# Altium schematic sheet [4] Programming_UART.SchDoc
size A4
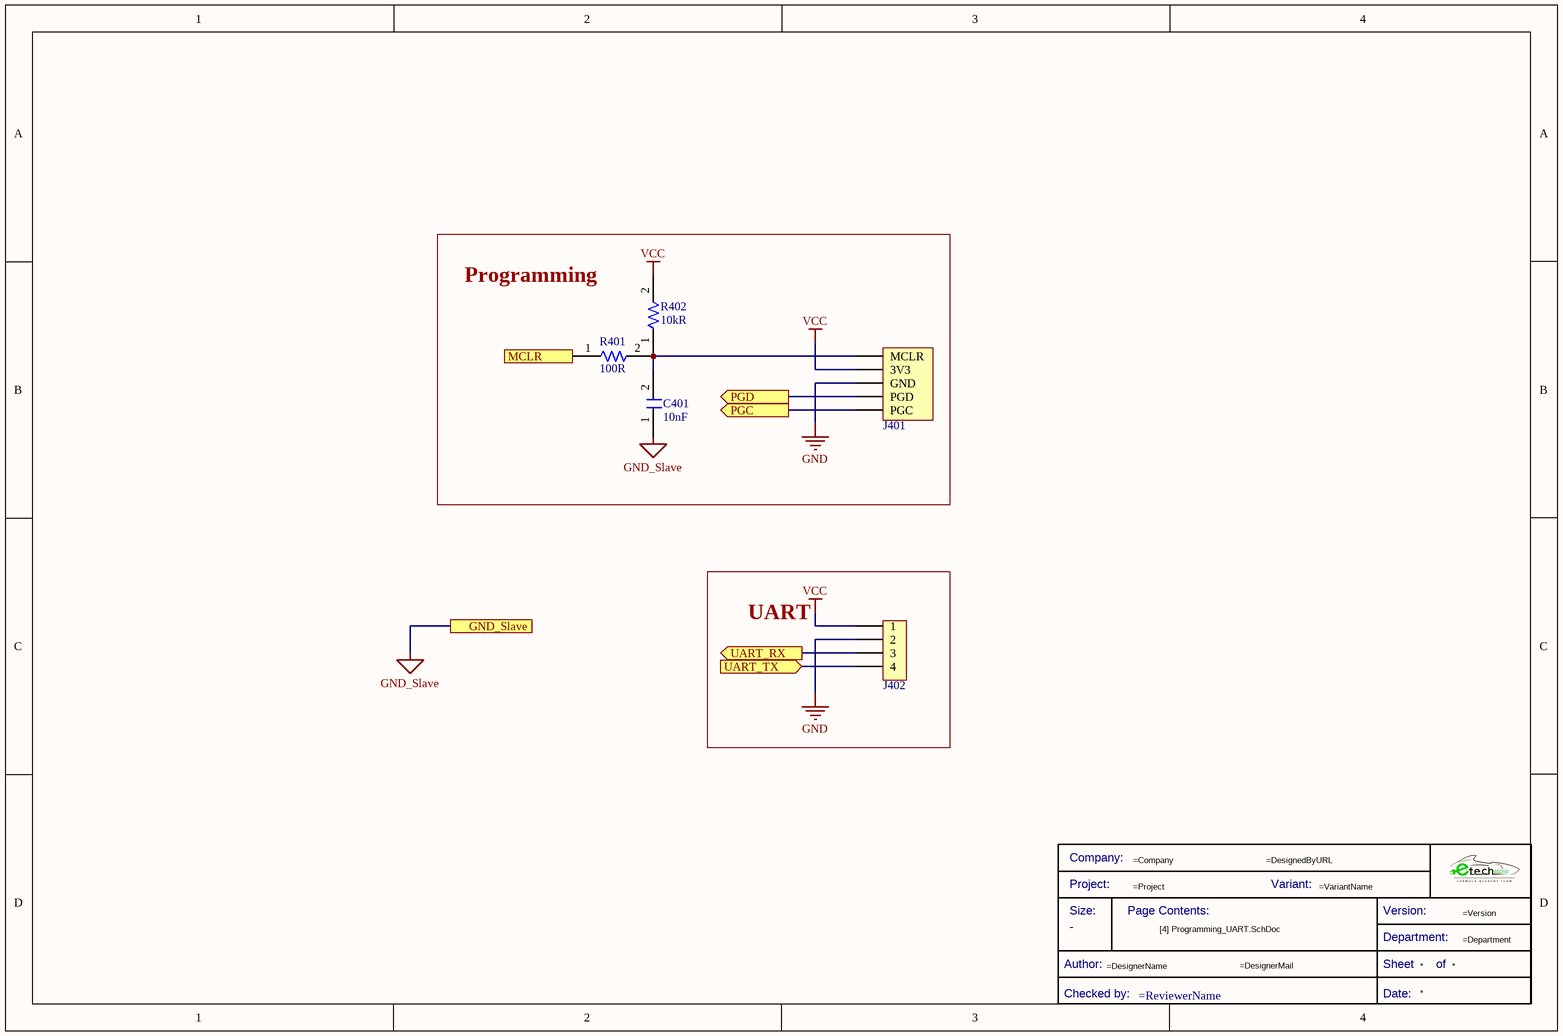
[diagram p0: [4] Programming_UART.SchDoc]

## Parts
*?  Title Block_template  (value not drawn)  (graphical)
C401  Capacitance: 10nF  [C0805FNPC-R]  (hidden comment: 885012207092)
J401  61300511121  [J_PinHeader_1x5]  (value not drawn)
J402  61300411121  [J_PinHeader_1x4]  (value not drawn)
R401  Resistance: 100R  [R0805FTK]  (hidden comment: CR0805-FX-1000ELF)
R402  Resistance: 10kR  [R0805FTK]  (hidden comment: CR0805-JW-103ELF)

## Blocks framed on the sheet
Programming: C401 J401 R401 R402
UART: J402

## Ports
GND_Slave, MCLR (out), PGC (out), PGD (out), UART_RX (out), UART_TX (in)

## Nets
GND: J401.3(GND) J402.2
GND_Slave: C401.1 ; port GND_Slave
VCC: J401.2(3V3) J402.1 R402.2
MCLR: R401.1 ; port MCLR
PGC: J401.5(PGC) ; port PGC
PGD: J401.4(PGD) ; port PGD
UART_RX: J402.3 ; port UART_RX
UART_TX: J402.4 ; port UART_TX
NetC401_2: C401.2 J401.1(MCLR) R401.2 R402.1

## Notes on the sheet
- Title
- Size:
- Date:
- A4
- Number:
- Time:
- Revision:
- Sheet
- of
- File:
- (in symbol Title Block_template) Company:; Project:; Variant:; Size:; Page Contents:; Version:; Department:; Author:; Sheet; of; Checked by:; Date:

## Library data of the parts
*? = Title Block_template: Standard Title Block; Category: Title Block; Checked by:: =ReviewerName; Size: -
C401 = C10n-50V-0805FNPC-X7R: Cap, 0.01ΜF, 50V, 10%, X7R, 0805; Manufacturer 1: Wurth Electronics; .Creator: DR; Supplier 1: RSComponents; Manufacturer Part Number 1: 885012207092; RoHS: Yes; Category: Ceramic Capacitors; Stock 1: 1; Pricing 1: 4000=0,03200, 12000=0,03100 (USD); Mount: Surface Mount; Case/Package: 0805; Case Code (Metric): 2012; Case Code (Imperial): 0805; Min Operating Temperature: -55°C; Max Operating Temperature: 125°C; Packaging: Cut Tape; Voltage Rating: 50V; Dielectric: X7R; Tolerance: 10%; Voltage Rating (DC): 50V; Length: 0.079inch; Width: 0.049inch; Thickness: 0.035inch; REACH SVHC: Unknown; RoHS Compliant: Yes; ComponentLink1URL: http://www.farnell.com/datasheets/1958497.pdf?src-supplier=Farnell; ComponentLink1Description: http://www.farnell.com/datasheets/1958497.pdf?src-supplier=Farnell; ComponentLink2URL: http://www.farnell.com/datasheets/1958497.pdf?src-supplier=Element14; ComponentLink2Description: http://www.farnell.com/datasheets/1958497.pdf?src-supplier=Element14; ComponentLink3URL: http://www.farnell.com/datasheets/1958497.pdf?src-supplier=Newark; ComponentLink3Description: http://www.farnell.com/datasheets/1958497.pdf?src-supplier=Newark; ComponentLink4URL: https://katalog.we-online.de/pbs/datasheet/885012207092.pdf?src-supplier=Digi-Key; ComponentLink4Description: https://katalog.we-online.de/pbs/datasheet/885012207092.pdf?src-supplier=Digi-Key; Supplier Part Number 1: 1813941
J401 = J_Bootloader_PIC: THT Vertical Pin Header WR-PHD, Pitch 2.54 mm, Single Row, 5 pins; Manufacturer: Molex; Temperature rating: -40° to +105°C; Category type: PCB-PCB; Maximum current: 3 A; Maximum voltage: 250 V AC; Connections: 1x5; Number of Positions: 5; Gender: Male; Connector Type: Male Pin; Pitch: 0.1inch; .Creator: GP; Category: Connector; ComponentLink1Description: Datasheet; ComponentLink1URL: https://www.we-online.com/catalog/datasheet/61300511121.pdf; ComponentLink2Description: Where buy it; ComponentLink2URL: https://www.we-online.com/catalog/en/PHD_2_54_THT_PIN_HEADER_6130XX11121?sq=61300511121&sp=https%3A%2F%2Fwww.we-online.com%2Fweb%2Fen%2Fwuerth_elektronik%2Fsearchpage.php%3Fsearch%3D61300511121#61300511121; Manufacturer part number: 61300511121; Supplier: Würth Elektronik; RoHS: *; Application: Charge program; Product name: Pin Header; Flammability: 94V-0; Orientation: vertical; Mount: Through hole; Supplier 1: Mouser; Stock 1: 1878; Pricing 1: 1=0,26000, 10=0,21600, 25=0,18000, 50=0,15000, 100=0,13700, 1000=0,12400, 10000=0,12400 (USD); Contact Plating: Gold; Contact Material: Copper; Color: Black; Number of Rows: 1; Packaging: Bulk; Termination: Solder; Number of Contacts: 5; Contact Mating Length: 0.236inch; REACH SVHC: Unknown; Lead Free: Lead Free; ComponentLink3URL: http://www.farnell.com/cad/1737268.pdf?src-supplier=Element14; ComponentLink3Description: http://www.farnell.com/cad/1737268.pdf?src-supplier=Element14; ComponentLink4URL: https://katalog.we-online.de/em/datasheet/6130xx11121.pdf?src-supplier=Digi-Key; ComponentLink4Description: https://katalog.we-online.de/em/datasheet/6130xx11121.pdf?src-supplier=Digi-Key; Supplier Part Number 1: 710-61300511121
J402 = J_UART: CONN HEADER 4 POS 2.54; Manufacturer 1: Wurth Electronics; Number of Positions: 4; Gender: Male; Connector Type: Male Pin; Pitch: 0.1inch; .Creator: AC; Supplier 1: RSComponents; Manufacturer Part Number 1: 61300411121; RoHS: Yes; Category: Headers and Wire Housings; Stock 1: 1; Pricing 1: 5=0,19500, 250=0,08000, 500=0,07700, 2500=0,07500, 5000=0,07200 (USD); Mount: Through Hole; Contact Plating: Gold; Contact Material: Copper; Color: Black; Number of Rows: 1; Packaging: Bulk; Termination: Solder; Number of Contacts: 4; Contact Mating Length: 0.236inch; REACH SVHC: Unknown; Lead Free: Lead Free; RoHS Compliant: Yes; ComponentLink1URL: http://www.farnell.com/cad/1737268.pdf?src-supplier=Element14; ComponentLink1Description: http://www.farnell.com/cad/1737268.pdf?src-supplier=Element14; ComponentLink2URL: https://katalog.we-online.de/em/datasheet/6130xx11121.pdf?src-supplier=Digi-Key; ComponentLink2Description: https://katalog.we-online.de/em/datasheet/6130xx11121.pdf?src-supplier=Digi-Key; Supplier Part Number 1: 8281594
R401 = R100-0805FTK: Res Thick Film 0805 100 Ohm 1% 1/8W ±100ppm/°C Molded SMD SMD Paper Tape on Plastic Reel; Manufacturer 1: Bourns; Power Rating: 125mW; Voltage Rating: 150V; .Creator: DR; Supplier 1: Arrow Electronics; Manufacturer Part Number 1: CR0805-FX-1000ELF; RoHS: Yes; Category: Chip SMD Resistors; Stock 1: 49802; Pricing 1: 1=0,05840, 10=0,03430, 25=0,01780, 100=0,00750, 250=0,00560, 500=0,00490, 3000=0,00470 (USD); Mount: Surface Mount; Case/Package: 0805; Number of Pins: 2; Contact Plating: Tin; Case Code (Imperial): 0805; Case Code (Metric): 2012; Min Operating Temperature: -55°C; Max Operating Temperature: 155°C; Tolerance: 1%; Resistor Type: Thick Film; Temperature Coefficient: 100ppm/°C; Packaging: Tape and Reel; Package Quantity: 1; Termination: SMD/SMT; Number of Terminations: 2; Max Power Dissipation: 125mW; Voltage Rating (DC): 150V; Features: Moisture Resistant; Series: CR0805; Resistance Tolerance: 1%; Construction: Rectangular; Technology: THICK FILM; Length: 2mm; Width: 1.25mm; Height: 0.5mm; Depth: 1.25mm; Thickness: 508um; Radiation Hardening: No; REACH SVHC: No SVHC; Military Standard: Not; RoHS Compliant: Yes; ComponentLink1URL: https://datasheet.ciiva.com/11809/0900766b80fcdb72-11809178.pdf?src-supplier=RSComponents; ComponentLink1Description: https://datasheet.ciiva.com/11809/0900766b80fcdb72-11809178.pdf?src-supplier=RSComponents; ComponentLink2URL: https://datasheet.ciiva.com/6547/chpreztr-6547413.pdf?src-supplier=Digi-Key; ComponentLink2Description: https://datasheet.ciiva.com/6547/chpreztr-6547413.pdf?src-supplier=Digi-Key; ComponentLink3URL: https://datasheet.ciiva.com/6547/chpreztr-6547414.pdf?src-supplier=Digi-Key; ComponentLink3Description: https://datasheet.ciiva.com/6547/chpreztr-6547414.pdf?src-supplier=Digi-Key; ComponentLink4URL: https://datasheet.ciiva.com/6547/chpreztr-6547415.pdf?src-supplier=Digi-Key; ComponentLink4Description: https://datasheet.ciiva.com/6547/chpreztr-6547415.pdf?src-supplier=Digi-Key; ComponentLink5URL: https://datasheet.ciiva.com/9120/chpreztr-9120744.pdf?src-supplier=Avnet; ComponentLink5Description: https://datasheet.ciiva.com/9120/chpreztr-9120744.pdf?src-supplier=Avnet; Supplier Part Number 1: CR0805-FX-1000ELF
R402 = R10k-0805FTK: BOURNS         CR0805-JW-103ELF            Surface Mount Chip Resistor, Thick Film, CR Series, 10 kohm, 125 mW,  5%, 150 V; Temperature Coefficient: 200ppm/°C; Power Rating: 125mW; Voltage Rating: 150V; Voltage Rating (DC): 100V; .Creator: DR; Supplier 1: Arrow Electronics; Manufacturer 1: Bourns; Manufacturer Part Number 1: CR0805-JW-103ELF; RoHS: Yes; Category: Chip SMD Resistors; Stock 1: 57566; Pricing 1: 1=0,05790, 10=0,01540, 25=0,01340, 100=0,00340 (USD); Mount: Surface Mount; Case/Package: 0805; Number of Pins: 2; Contact Plating: Tin; Case Code (Metric): 2012; Case Code (Imperial): 0805; Min Operating Temperature: -55°C; Max Operating Temperature: 155°C; Tolerance: 5%; Resistor Type: Thick Film; Package Quantity: 1; Packaging: Tape and Reel; Number of Terminations: 2; Termination: SMD/SMT; Max Power Dissipation: 125mW; Features: Moisture Resistant; Series: CR0805; Construction: Rectangular; Resistance Tolerance: 5%; Technology: THICK FILM; Length: 2mm; Width: 1.25mm; Height: 0.5mm; Depth: 1.25mm; Thickness: 508um; Radiation Hardening: No; REACH SVHC: No SVHC; Military Standard: Not; RoHS Compliant: Yes; ComponentLink1URL: https://datasheet.ciiva.com/11821/0900766b80fcdb72-11821135.pdf?src-supplier=RSComponents; ComponentLink1Description: https://datasheet.ciiva.com/11821/0900766b80fcdb72-11821135.pdf?src-supplier=RSComponents; ComponentLink2URL: https://datasheet.ciiva.com/9122/chpreztr-9122374.pdf?src-supplier=Avnet; ComponentLink2Description: https://datasheet.ciiva.com/9122/chpreztr-9122374.pdf?src-supplier=Avnet; ComponentLink3URL: https://datasheet.ciiva.com/22693/1902866-22693254.pdf?src-supplier=Element14; ComponentLink3Description: https://datasheet.ciiva.com/22693/1902866-22693254.pdf?src-supplier=Element14; ComponentLink4URL: https://datasheet.ciiva.com/7986/691949-7986187.pdf?src-supplier=Element14; ComponentLink4Description: https://datasheet.ciiva.com/7986/691949-7986187.pdf?src-supplier=Element14; ComponentLink5URL: https://datasheet.ciiva.com/30065/159chpreztr-30065976.pdf?src-supplier=Onlinecomponents.com; ComponentLink5Description: https://datasheet.ciiva.com/30065/159chpreztr-30065976.pdf?src-supplier=Onlinecomponents.com; ComponentLink6URL: https://datasheet.ciiva.com/16783/70154685-16783482.pdf?src-supplier=Allied+Electronics; ComponentLink6Description: https://datasheet.ciiva.com/16783/70154685-16783482.pdf?src-supplier=Allied+Electronics; ComponentLink7URL: https://datasheet.ciiva.com/5548/chpreztr-5548491.pdf?src-supplier=Mouser; ComponentLink7Description: https://datasheet.ciiva.com/5548/chpreztr-5548491.pdf?src-supplier=Mouser; ComponentLink8URL: https://datasheet.ciiva.com/6559/chpreztr-6559900.pdf?src-supplier=Digi-Key; ComponentLink8Description: https://datasheet.ciiva.com/6559/chpreztr-6559900.pdf?src-supplier=Digi-Key; ComponentLink9URL: https://datasheet.ciiva.com/6559/chpreztr-6559901.pdf?src-supplier=Digi-Key; ComponentLink9Description: https://datasheet.ciiva.com/6559/chpreztr-6559901.pdf?src-supplier=Digi-Key; ComponentLink10URL: https://datasheet.ciiva.com/7985/1856384-7985869.pdf?src-supplier=Element14; ComponentLink10Description: https://datasheet.ciiva.com/7985/1856384-7985869.pdf?src-supplier=Element14; ComponentLink11URL: https://datasheet.ciiva.com/48692/001055517-da-01-en-smd-wid-cr0805-jw-103elf-10k-ohm-1-8w-48692118.pdf?src-supplier=Conrad; ComponentLink11Description: https://datasheet.ciiva.com/48692/001055517-da-01-en-smd-wid-cr0805-jw-103elf-10k-ohm-1-8w-48692118.pdf?src-supplier=Conrad; Supplier Part Number 1: CR0805-JW-103ELF